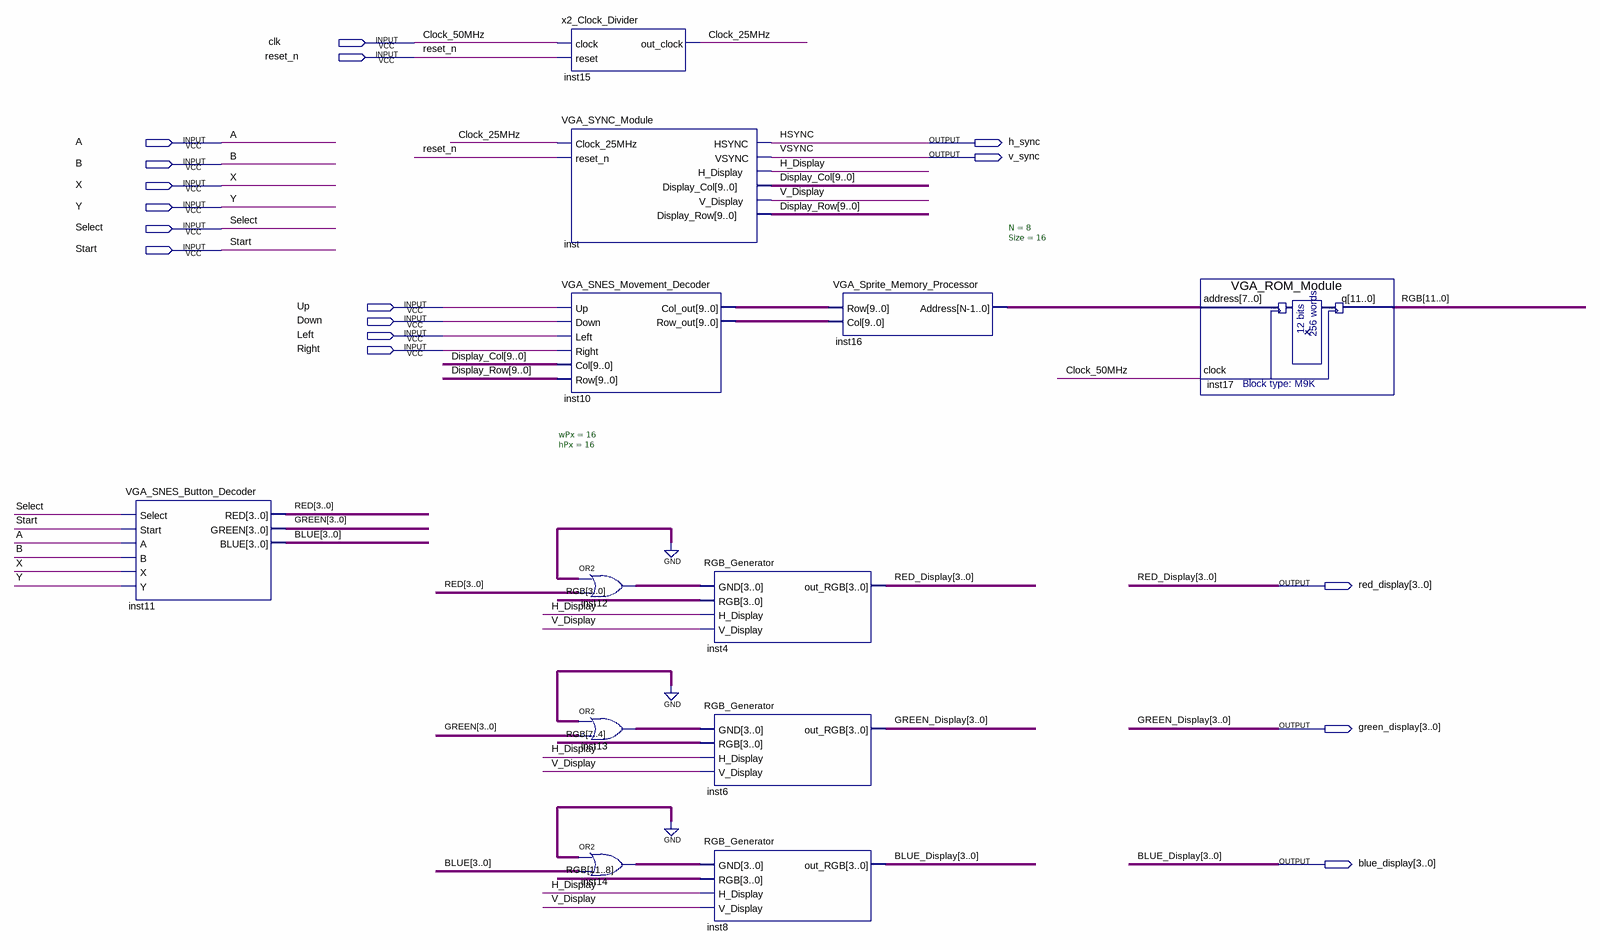
[diagram p0: schematic sheet]
// Quartus schematic VGA_Display_Module.bdf as structural Verilog: 12 symbols, 17 pins
module VGA_Display_Module (
  input  clk,
  input  reset_n,
  input  A,
  input  B,
  input  X,
  input  Y,
  input  Select,
  input  Start,
  input  Up,
  input  Down,
  input  Left,
  input  Right,
  output h_sync,
  output v_sync,
  output [3:0] red_display,
  output [3:0] green_display,
  output [3:0] blue_display
);

  wire Clock_25MHz, H_Display, V_Display;
  wire [3:0] BLUE, GREEN, inst12_out, inst13_out, inst14_out, RED;
  wire [7:0] inst16_address;
  wire [9:0] Display_Col, Display_Row, inst10_col_out, inst10_row_out;
  wire [11:0] RGB;

  VGA_SNES_Button_Decoder inst11 (
    .Select(Select), .Start(Start), .A(A), .B(B), .X(X), .Y(Y), .RED(RED), .GREEN(GREEN), .BLUE(BLUE));
  x2_Clock_Divider inst15 (.clock(clk), .reset(reset_n), .out_clock(Clock_25MHz));
  VGA_SYNC_Module inst (
    .Clock_25MHz(Clock_25MHz), .reset_n(reset_n), .HSYNC(h_sync), .VSYNC(v_sync), .H_Display(H_Display),
    .Display_Col(Display_Col), .V_Display(V_Display), .Display_Row(Display_Row));
  VGA_SNES_Movement_Decoder #(.wPx(16), .hPx(16)) inst10 (
    .Up(Up), .Down(Down), .Left(Left), .Right(Right), .Col(Display_Col), .Row(Display_Row),
    .Col_out(inst10_col_out), .Row_out(inst10_row_out));
  assign inst12_out = 4'b0000 | RED;  // OR2 inst12, 4 bits wide
  assign inst13_out = 4'b0000 | GREEN;  // OR2 inst13, 4 bits wide
  assign inst14_out = 4'b0000 | BLUE;  // OR2 inst14, 4 bits wide
  RGB_Generator inst4 (
    .GND(inst12_out), .RGB(RGB[3:0]), .H_Display(H_Display), .V_Display(V_Display), .out_RGB(red_display));
  RGB_Generator inst6 (
    .GND(inst13_out), .RGB(RGB[7:4]), .H_Display(H_Display), .V_Display(V_Display), .out_RGB(green_display));
  RGB_Generator inst8 (
    .GND(inst14_out), .RGB(RGB[11:8]), .H_Display(H_Display), .V_Display(V_Display), .out_RGB(blue_display));
  VGA_Sprite_Memory_Processor #(.N(8), .Size(16)) inst16 (
    .Row(inst10_col_out), .Col(inst10_row_out), .Address(inst16_address));
  VGA_ROM_Module inst17 (.address(inst16_address), .clock(clk), .q(RGB));

  // Other names for the same wires on the sheet: Clock_50MHz = clk; HSYNC = h_sync; VSYNC = v_sync
endmodule
